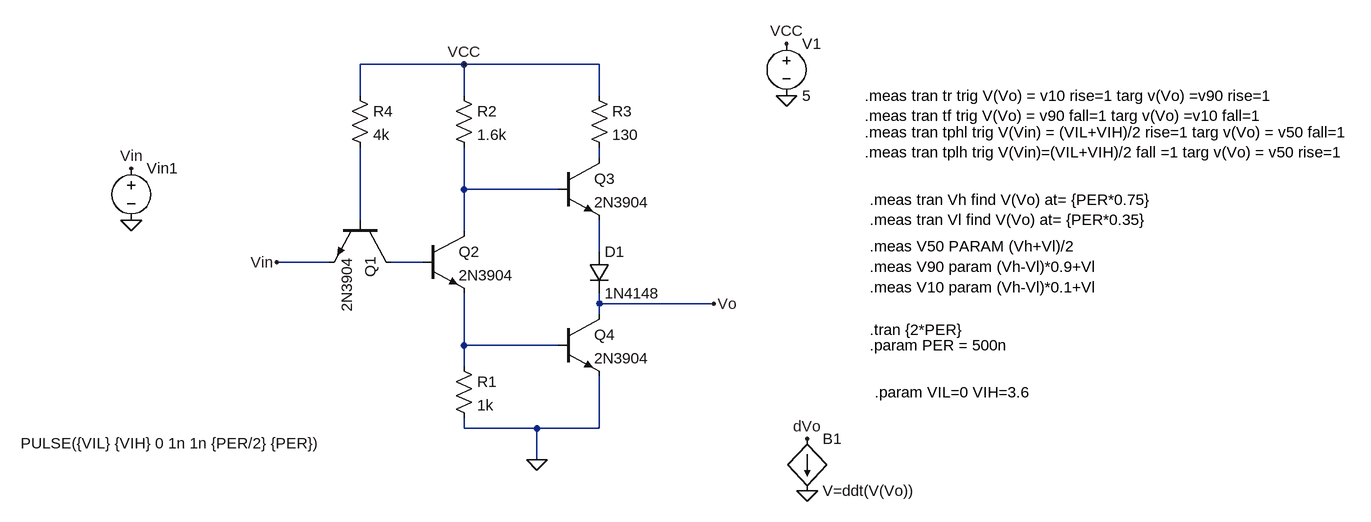
[diagram p0: schematic TTL_inverter_propagation.asc]
TTL_inverter_propagation.asc, the LTspice schematic file:
Version 4
SHEET 1 1948 680
WIRE 480 -192 320 -192
WIRE 688 -192 480 -192
WIRE 320 -144 320 -192
WIRE 480 -144 480 -192
WIRE 688 -144 688 -192
WIRE 688 -48 688 -64
WIRE 480 0 480 -64
WIRE 624 0 480 0
WIRE 320 48 320 -64
WIRE 480 64 480 0
WIRE 688 96 688 48
WIRE 272 112 192 112
WIRE 416 112 368 112
WIRE 688 176 688 160
WIRE 864 176 688 176
WIRE 688 192 688 176
WIRE 480 240 480 160
WIRE 624 240 480 240
WIRE 480 272 480 240
WIRE 480 368 480 352
WIRE 592 368 480 368
WIRE 688 368 688 288
WIRE 688 368 592 368
WIRE 592 416 592 368
FLAG 592 416 0
FLAG 864 176 Vo
FLAG 192 112 Vin
FLAG 976 -144 0
FLAG 976 -224 VCC
FLAG 480 -192 VCC
FLAG 1008 464 0
FLAG 1008 384 dVo
FLAG -32 48 0
FLAG -32 -32 Vin
SYMBOL npn 368 48 R90
SYMATTR InstName Q1
SYMATTR Value 2N3904
SYMBOL npn 416 64 R0
SYMATTR InstName Q2
SYMATTR Value 2N3904
SYMBOL npn 624 -48 R0
SYMATTR InstName Q3
SYMATTR Value 2N3904
SYMBOL npn 624 192 R0
SYMATTR InstName Q4
SYMATTR Value 2N3904
SYMBOL diode 672 96 R0
SYMATTR InstName D1
SYMATTR Value 1N4148
SYMBOL res 464 256 R0
SYMATTR InstName R1
SYMATTR Value 1k
SYMBOL res 464 -160 R0
SYMATTR InstName R2
SYMATTR Value 1.6k
SYMBOL res 672 -160 R0
SYMATTR InstName R3
SYMATTR Value 130
SYMBOL res 304 -160 R0
SYMATTR InstName R4
SYMATTR Value 4k
SYMBOL voltage 976 -240 R0
WINDOW 123 0 0 Left 0
WINDOW 39 0 0 Left 0
SYMATTR InstName V1
SYMATTR Value 5
SYMBOL bi 1008 384 R0
SYMATTR InstName B1
SYMATTR Value V=ddt(V(Vo))
SYMBOL voltage -32 -48 R0
WINDOW 123 0 0 Left 0
WINDOW 39 0 0 Left 0
WINDOW 3 -170 439 Left 2
SYMATTR Value PULSE({VIL} {VIH} 0 1n 1n {PER/2} {PER})
SYMATTR InstName Vin1
TEXT 1096 -144 Left 2 !.meas tran tr trig V(Vo) = v10 rise=1 targ v(Vo) =v90 rise=1\n.meas tran tf trig V(Vo) = v90 fall=1 targ v(Vo) =v10 fall=1
TEXT 1096 -88 Left 2 !.meas tran tphl trig V(Vin) = (VIL+VIH)/2 rise=1 targ v(Vo) = v50 fall=1\n.meas tran tplh trig V(Vin)=(VIL+VIH)/2 fall =1 targ v(Vo) = v50 rise=1
TEXT 1104 16 Left 2 !.meas tran Vh find V(Vo) at= {PER*0.75}\n.meas tran Vl find V(Vo) at= {PER*0.35}
TEXT 1104 88 Left 2 !.meas V50 PARAM (Vh+Vl)/2\n.meas V90 param (Vh-Vl)*0.9+Vl\n.meas V10 param (Vh-Vl)*0.1+Vl
TEXT 1104 216 Left 2 !.tran {2*PER}
TEXT 1104 240 Left 2 !.param PER = 500n
TEXT 1112 312 Left 2 !.param VIL=0 VIH=3.6

The netlist it stands for:
* TTL_inverter_propagation.asc
Q1 N005 N003 Vin 0 2N3904
Q2 N002 N005 N006 0 2N3904
Q3 N001 N002 N004 0 2N3904
Q4 Vo N006 0 0 2N3904
D1 N004 Vo 1N4148
R1 N006 0 1k
R2 VCC N002 1.6k
R3 VCC N001 130
R4 VCC N003 4k
V1 VCC 0 5
B1 dVo 0 V=ddt(V(Vo))
Vin1 Vin 0 PULSE({VIL} {VIH} 0 1n 1n {PER/2} {PER})
.model D D
.lib standard.dio
.model NPN NPN
.model PNP PNP
.lib standard.bjt
.meas tran tr trig V(Vo) = v10 rise=1 targ v(Vo) =v90 rise=1
.meas tran tf trig V(Vo) = v90 fall=1 targ v(Vo) =v10 fall=1
.meas tran tphl trig V(Vin) = (VIL+VIH)/2 rise=1 targ v(Vo) = v50 fall=1
.meas tran tplh trig V(Vin)=(VIL+VIH)/2 fall =1 targ v(Vo) = v50 rise=1
.meas tran Vh find V(Vo) at= {PER*0.75}
.meas tran Vl find V(Vo) at= {PER*0.35}
.meas V50 PARAM (Vh+Vl)/2
.meas V90 param (Vh-Vl)*0.9+Vl
.meas V10 param (Vh-Vl)*0.1+Vl
.tran {2*PER}
.param PER = 500n
.param VIL=0 VIH=3.6
.backanno
.end